# Altium project DRIVER_WITH_MOS.PrjPCB
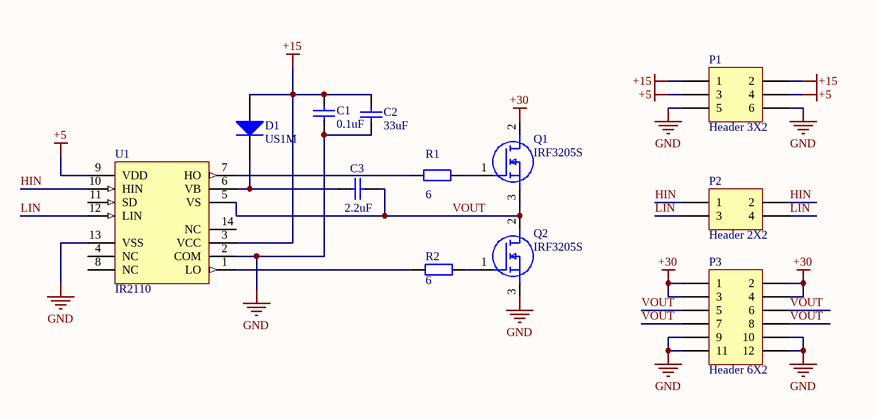
[diagram p0: DRIVER_WITH_MOS.SchDoc]
1 sheet, 12 parts. Net scope: global (net labels, ports and power ports of the same name join across sheets).
Board file: DRIVER_WITH_MOS.PcbDoc

## Sheet DRIVER_WITH_MOS.SchDoc
size A4

### Parts
C1  value 0.1uF  [1608[0603]]  (hidden comment: Cap)
C2  value 33uF  [C1210]  (hidden comment: Cap)
C3  value 2.2uF  [C1210]  (hidden comment: Cap)
D1  US1M  [DIOM5127X229N]
P1  Header 3X2  [HDR2X3]
P2  Header 2X2  [HDR2X2]
P3  Header 6X2  [HDR2X6]
Q1  IRF3205S  [TO254P469X1042X1930-3P]
Q2  IRF3205S  [TO254P469X1042X1930-3P]
R1  value 6  [0402]  (hidden comment: Res2)
R2  value 6  [0402]  (hidden comment: Res2)
U1  IR2110  [DIP-14]

### Nets
+5: P1.3 P1.4 U1.9(VDD)
+15: C1.2 C2.1 D1.1(A) P1.1 P1.2 U1.3(VCC)
+30: P3.1 P3.2 P3.3 P3.4 Q1.2(D)
GND: C1.1 C2.2 P1.5 P1.6 P3.9 P3.10 P3.11 P3.12 Q2.3(S) U1.2(COM) U1.13(VSS)
HIN: P2.1 P2.2 U1.10(HIN)
LIN: P2.3 P2.4 U1.12(LIN)
VOUT: C3.2 P3.5 P3.6 P3.7 P3.8 Q1.3(S) Q2.2(D) U1.5(VS)
NetC3_1: C3.1 D1.2(K) U1.6(VB)
NetQ1_1: Q1.1(G) R1.2
NetQ2_1: Q2.1(G) R2.2
NetR1_1: R1.1 U1.7(HO)
NetR2_1: R2.1 U1.1(LO)

Not connected (* = marked no-connect by the designer): U1 4(NC) 8(NC) 11(SD) 14(NC)

### Library data of the parts
C1-C3 = Cap: Capacitor; Published: 8-Jun-2000; LatestRevisionDate: 17-Jul-2002; LatestRevisionNote: Re-released for DXP Platform.; PackageReference: RAD-0.3; Publisher: Altium Limited; PackageDescription: Radial Cap, Thru-Hole; 2 Leads; 0.3 in Pin Spacing
D1 = 1N4148: High Conductance Fast Diode; Published: 8-Jun-2000; LatestRevisionDate: 17-Jul-2002; LatestRevisionNote: Re-released for DXP Platform.; DatasheetDocument: 1997; PackageReference: DO-35; Publisher: Altium Limited; Code_JEDEC: DO-204-AH; ComponentLink1Description: Manufacturer Link; ComponentLink1URL: http://www.fairchildsemi.com/; ComponentLink2Description: Datasheet; ComponentLink2URL: http://www.fairchildsemi.com/ds/1N%2F1N4148.pdf
P1 = Header 3X2: Header, 3-Pin, Dual row; LatestRevisionDate: 17-Jul-2002; LatestRevisionNote: Re-released for DXP Platform.; Publisher: Altium Limited
P2 = Header 2X2: Header, 2-Pin, Dual row; LatestRevisionDate: 17-Jul-2002; LatestRevisionNote: Re-released for DXP Platform.; Publisher: Altium Limited
P3 = Header 6X2: Header, 6-Pin, Dual row; LatestRevisionDate: 17-Jul-2002; LatestRevisionNote: Re-released for DXP Platform.; Publisher: Altium Limited
Q1 Q2 = IRF3205S: MOSFET (N-Channel); Manufacturer_Name: International Rectifier; Datasheet Link: http://www.irf.com/product-info/datasheets/data/irf3205.pdf; Height: 4.69mm; Manufacturer_Part_Number: IRF3205S; RS Part Number: 3954859; RS Price/Stock: http://uk.rs-online.com/web/p/products/3954859
R1 R2 = Res2: Resistor; Published: 8-Jun-2000; LatestRevisionDate: 17-Jul-2002; LatestRevisionNote: Re-released for DXP Platform.; PackageReference: AXIAL-0.4; Publisher: Altium Limited; PackageDescription: Axial Device, Thru-Hole; 2 Leads; 0.4 in Pin Spacing
U1 = IR2110: High and Low Side Driver; Note: Pins 4, 8 and 14 are not connected; Published: 8-Jun-2000; LatestRevisionDate: 04-Mar-2005; LatestRevisionNote: Stylized 3D Model Added.; DatasheetVersion: PD60147J; PackageReference: PDIP14; Publisher: Altium Limited; PackageDescription: DIP; 14 Leads; Row Spacing 7.62 mm; Pitch 2.54 mm; ComponentLink1Description: Manufacturer Link; ComponentLink1URL: http://www.irf.com/; ComponentLink2Description: Datasheet; ComponentLink2URL: http://www.irf.com/product-info/datasheets/data/ir2110.pdf